# Altium schematic sheet Board.SchDoc
size A; SheetNumber: 1; SheetTotal: 1
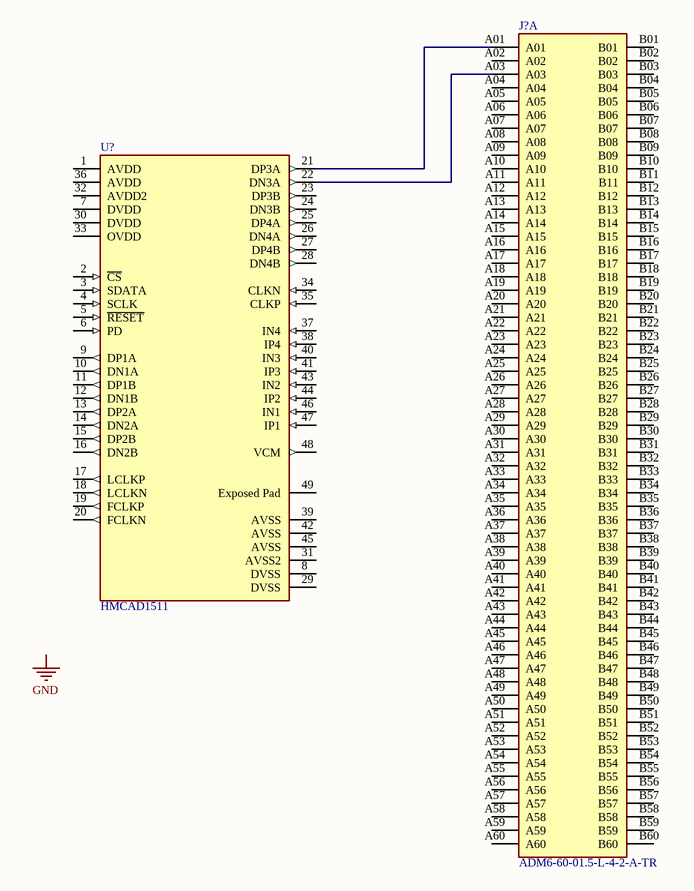
[diagram p0: Board.SchDoc]

## Parts
J?  ADM6-60-01.5-L-4-2-A-TR  [SAMTEC_ADM6-60-01.5-L-4-2-A-TR]  (part A of 2)
U?  HMCAD1511  [FP-HMCAD1511-IPC_C]

## Nets
NetJ?_A01: J?.A01 U?.21(DP3A)
NetJ?_A03: J?.A03 U?.22(DN3A)

Not connected (* = marked no-connect by the designer): J? A02 A04 A05 A06 A07 A08 A09 A10 A11 A12 A13 A14 A15 A16 A17 A18 A19 A20 A21 A22 A23 A24 A25 A26 A27 A28 A29 A30 A31 A32 A33 A34 A35 A36 A37 A38 A39 A40 A41 A42 A43 A44 A45 A46 A47 A48 A49 A50 A51 A52 A53 A54 A55 A56 A57 A58 A59 A60 B01 B02 B03 B04 B05 B06 B07 B08 B09 B10 B11 B12 B13 B14 B15 B16 B17 B18 B19 B20 B21 B22 B23 B24 B25 B26 B27 B28 B29 B30 B31 B32 B33 B34 B35 B36 B37 B38 B39 B40 B41 B42 B43 B44 B45 B46 B47 B48 B49 B50 B51 B52 B53 B54 B55 B56 B57 B58 B59 B60; U? 1(AVDD) 2(~{CS}) 3(SDATA) 4(SCLK) 5(~{RESET}) 6(PD) 7(DVDD) 8(DVSS) 9(DP1A) 10(DN1A) 11(DP1B) 12(DN1B) 13(DP2A) 14(DN2A) 15(DP2B) 16(DN2B) 17(LCLKP) 18(LCLKN) 19(FCLKP) 20(FCLKN) 23(DP3B) 24(DN3B) 25(DP4A) 26(DN4A) 27(DP4B) 28(DN4B) 29(DVSS) 30(DVDD) 31(AVSS2) 32(AVDD2) 33(OVDD) 34(CLKN) 35(CLKP) 36(AVDD) 37(IN4) 38(IP4) 39(AVSS) 40(IN3) 41(IP3) 42(AVSS) 43(IN2) 44(IP2) 45(AVSS) 46(IN1) 47(IP1) 48(VCM) 49(Exposed_Pad)

## Notes on the sheet
- Labels drawn without touching a wire or pin: GND

## Library data of the parts
J? = ADM6-60-01.5-L-4-2-A-TR: 0.635 mm AcceleRate HD High-Density 4-Row Header; Package: None; Price: None; Value: *; MP: ADM6-60-01.5-L-4-2-A-TR; Availability: Unavailable
U? = CMP-09081-000016-1: IC ADC 8BIT PIPELINED 48QFN; Max Supply Voltage: 2V; Polarity: Bipolar; Number of Analog Inputs: 4; Differential Nonlinearity: 0.2LSB; Supply Type: Analog; Interface: LVDS; Operating Supply Voltage: 1.8V; Min Supply Voltage: 1.7V; Sampling Rate: 1GS/s; Resolution: 8b; Power Dissipation: 710mW; Number of Bits: 8; Integral Nonlinearity (INL): 0.5LSB; Package Quantity: 500; Contact Plating: Tin; Lead Free: Contains Lead; Mount: Surface Mount; Min Operating Temperature: -40°C; Packaging: Cut Strip; Case/Package: QFN; Max Operating Temperature: 85°C; Number of Pins: 48; Number of Inputs: 4; Number of A/D Converters: 4; REACH SVHC: No SVHC